# Altium schematic sheet hv_architecture.SchDoc
size B; SheetNumber: 3
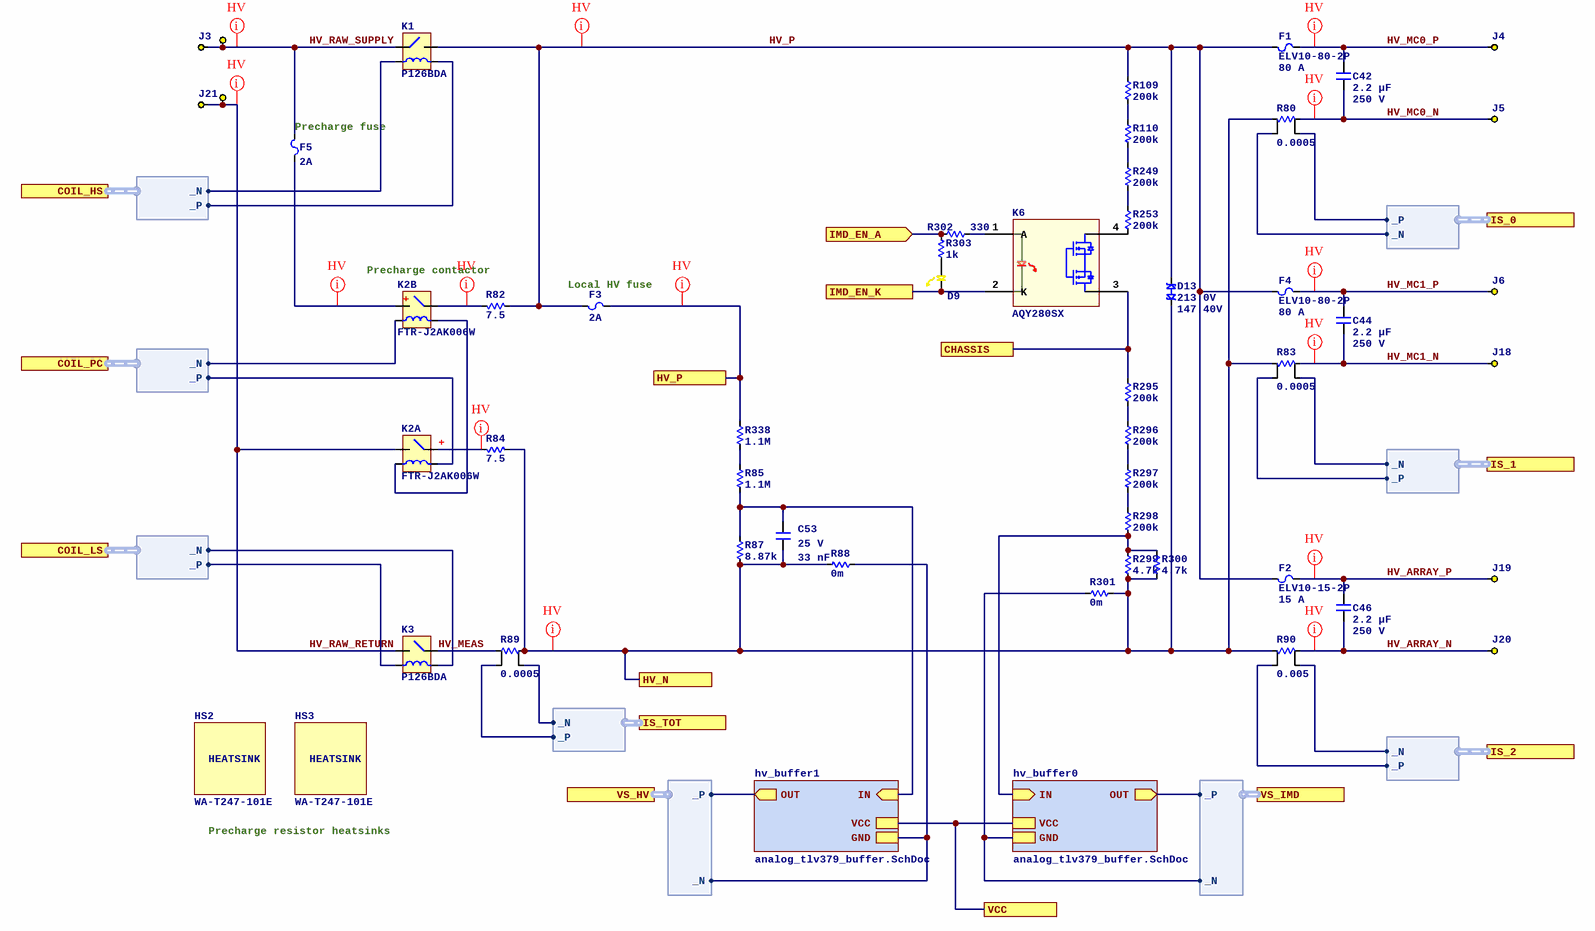
[diagram p0: hv_architecture.SchDoc]

## Parts
C42  Capacitance: 2.2 µF  Voltage Rating: 250 V  [C2220]  (hidden comment: C5750X7T2E225KT000N)
C44  Capacitance: 2.2 µF  Voltage Rating: 250 V  [C2220]  (hidden comment: C5750X7T2E225KT000N)
C46  Capacitance: 2.2 µF  Voltage Rating: 250 V  [C2220]  (hidden comment: C5750X7T2E225KT000N)
C53  Voltage Rating: 25 V  Capacitance: 33 nF  [C0402]  (hidden comment: 0402B333K250NT)
D9  LTST-C190YKT  [LED_0603P_YELLOW]  (value not drawn)
D13  Clamping Voltage-Max: 213.0V  Min Breakdown Voltage: 147.40V  [P600_VERTICAL]  (hidden comment: 30KPA132CA)
F1  ELV10-80-2P  Current: 80 A  [EATON_ELV10-xx-2P]
F2  ELV10-15-2P  Current: 15 A  [EATON_ELV10-xx-2P]
F3  Current: 2A  [BELFUSE_0ZRE0200FF]  (hidden comment: 0ZRE0200FF1A)
F4  ELV10-80-2P  Current: 80 A  [EATON_ELV10-xx-2P]
F5  Current: 2A  [BELFUSE_0ZRE0200FF]  (hidden comment: 0ZRE0200FF1A)
HS2  WA-T247-101E  [OHMITE_WA-T247-101E]
HS3  WA-T247-101E  [OHMITE_WA-T247-101E]
J3  7461086  [WURTH_TERM_7461086]  (value not drawn)
J4  7461086  [WURTH_TERM_7461086]  (value not drawn)
J5  7461086  [WURTH_TERM_7461086]  (value not drawn)
J6  7461086  [WURTH_TERM_7461086]  (value not drawn)
J18  7461086  [WURTH_TERM_7461086]  (value not drawn)
J19  7461086  [WURTH_TERM_7461086]  (value not drawn)
J20  7461086  [WURTH_TERM_7461086]  (value not drawn)
J21  7461086  [WURTH_TERM_7461086]  (value not drawn)
K1  P126BDA  [RELAY_P126]
K2  FTR-J2AK006W  [RELAY_FTR-J2]  (parts A,B of 2)
K3  P126BDA  [RELAY_P126]
K6  AQY280SX  [PANASONIC_AQY28]
R80  value 0.0005  [VISHAY_WSL2726]  (hidden comment: WSL2726L5000FEB)
R82  value 7.5  [TO-247-2_VERTICAL]  (hidden comment: TEH100M7R50FE)
R83  value 0.0005  [VISHAY_WSL2726]  (hidden comment: WSL2726L5000FEB)
R84  value 7.5  [TO-247-2_VERTICAL]  (hidden comment: TEH100M7R50FE)
R85  value 1.1M  [R0805]  (hidden comment: RT0805BRD071M1L)
R87  value 8.87k  [R0402]  (hidden comment: TC0210B8871TCC)
R88  value 0m  [R0402]  (hidden comment: 0402WGF0000TCE)
R89  value 0.0005  [VISHAY_WSL2726]  (hidden comment: WSL2726L5000FEB)
R90  value 0.005  [VISHAY_WSL2726]  (hidden comment: WSL27265L000FEB)
R109  value 200k  [R0603]  (hidden comment: 0603WAF2003T5E)
R110  value 200k  [R0603]  (hidden comment: 0603WAF2003T5E)
R249  value 200k  [R0603]  (hidden comment: 0603WAF2003T5E)
R253  value 200k  [R0603]  (hidden comment: 0603WAF2003T5E)
R295  value 200k  [R0603]  (hidden comment: 0603WAF2003T5E)
R296  value 200k  [R0603]  (hidden comment: 0603WAF2003T5E)
R297  value 200k  [R0603]  (hidden comment: 0603WAF2003T5E)
R298  value 200k  [R0603]  (hidden comment: 0603WAF2003T5E)
R299  value 4.7k  [R0402]  (hidden comment: 0402WGF4701TCE)
R300  value 4.7k  [R0402]  (hidden comment: 0402WGF4701TCE)
R301  value 0m  [R0402]  (hidden comment: 0402WGF0000TCE)
R302  value 330  [R0402]  (hidden comment: 0402WGF3300TCE)
R303  value 1k  [R0402]  (hidden comment: 0402WGF1001TCE)
R338  value 1.1M  [R0805]  (hidden comment: RT0805BRD071M1L)
TP3  RH-5000  [TP_RH-5000]  (value not drawn)
TP79  RH-5001  [TP_RH-5001]  (value not drawn)

## Sub-sheets
hv_buffer0 = analog_tlv379_buffer.SchDoc: IN (in), VCC, GND, OUT (out)
hv_buffer1 = analog_tlv379_buffer.SchDoc: IN (in), VCC, GND, OUT (out)

## Ports
CHASSIS, COIL_HS (harness DIFF), COIL_LS (harness DIFF), COIL_PC (harness DIFF), HV_N, HV_P, IMD_EN_A (in), IMD_EN_K, IS_0 (harness DIFF), IS_1 (harness DIFF), IS_2 (harness DIFF), IS_TOT (harness DIFF), VCC, VS_HV (harness DIFF), VS_IMD (harness DIFF)

## Harnesses
DIFF: _N, _P
DIFF: _P, _N

## Nets
CHASSIS: K6.3 R295.2 ; port CHASSIS
HV_ARRAY_N: C46.2 J20.0 R90.1
HV_ARRAY_P: C46.1 F2.2 J19.0
HV_MC0_N: C42.2 J5.0 R80.1
HV_MC0_P: C42.1 F1.2 J4.0
HV_MC1_N: C44.2 J18.0 R83.1
HV_MC1_P: C44.1 F4.2 J6.0
HV_MEAS: K3.4 R89.1
HV_N: C53.2 D13.1 R80.2 R83.2 R84.2 R87.2 R88.2 R89.2 R90.2 R299.1 R300.1 R301.2 ; port HV_N
HV_P: D13.2 F1.1 F2.1 F3.1 F4.1 K1.3 R82.2 R109.2
HV_P: F3.2 R338.1 ; port HV_P  [a separate net that carries the same name]
HV_RAW_RETURN: J21.0 K2.6 K3.3 TP79.1
HV_RAW_SUPPLY: F5.1 J3.0 K1.4 TP3.1
IMD_EN_A: R302.2 R303.1 ; port IMD_EN_A
IMD_EN_K: D9.2 K6.2(K) ; port IMD_EN_K
VCC: port VCC, sheet hv_buffer0/VCC, sheet hv_buffer1/VCC
NetC53_1: C53.1 R85.2 R87.1 ; sheet hv_buffer1/IN
NetD9_1: D9.1 R303.2
NetF5_2: F5.2 K2.8
NetK1_1: K1.1 ; port COIL_HS._N
NetK1_2: K1.2 ; port COIL_HS._P
NetK2_1: K2.1 ; port COIL_PC._P
NetK2_2: K2.2 K2.3
NetK2_4: K2.4 ; port COIL_PC._N
NetK2_5: K2.5 R84.1
NetK2_7: K2.7 R82.1
NetK3_1: K3.1 ; port COIL_LS._N
NetK3_2: K3.2 ; port COIL_LS._P
NetK6_1: K6.1(A) R302.1
NetK6_4: K6.4 R253.1
NetR80_3: R80.3 ; port IS_0._P
NetR80_4: R80.4 ; port IS_0._N
NetR83_3: R83.3 ; port IS_1._N
NetR83_4: R83.4 ; port IS_1._P
NetR85_1: R85.1 R338.2
NetR88_1: R88.1 ; sheet hv_buffer1/GND, port VS_HV._N
NetR89_3: R89.3 ; port IS_TOT._P
NetR89_4: R89.4 ; port IS_TOT._N
NetR90_3: R90.3 ; port IS_2._N
NetR90_4: R90.4 ; port IS_2._P
NetR109_1: R109.1 R110.2
NetR110_1: R110.1 R249.2
NetR249_1: R249.1 R253.2
NetR295_1: R295.1 R296.2
NetR296_1: R296.1 R297.2
NetR297_1: R297.1 R298.2
NetR298_1: R298.1 R299.2 R300.2 ; sheet hv_buffer0/IN
NetR301_1: R301.1 ; sheet hv_buffer0/GND, port VS_IMD._N
(unnamed): sheet hv_buffer0/OUT, port VS_IMD._P
(unnamed): sheet hv_buffer1/OUT, port VS_HV._P

## Layout directives
net class HV: HV_ARRAY_N, HV_ARRAY_P, HV_MC0_N, HV_MC0_P, HV_MC1_N, HV_MC1_P, HV_N, HV_P, HV_RAW_RETURN, HV_RAW_SUPPLY, NetF5_2, NetK2_5, NetK2_7

## Notes on the sheet
- (near F5) Precharge fuse
- Precharge contactor
- (near F3) Local HV fuse
- Precharge resistor heatsinks
- (in symbol FTR-J2AK006W, part A) +
- (in symbol FTR-J2AK006W, part B) +
- (in symbol WA-T247-101E) HEATSINK

## Library data of the parts
C42 C44 C46 = C5750X7T2E225KT000N: Manufacturer: TDK; Dielectric: X7T; ComponentLink1URL: https://wmsc.lcsc.com/wmsc/upload/file/pdf/v2/lcsc/2304140030_TDK-C5750X7T2E225KT000N_C435266.pdf; ComponentLink1Description: Datasheet; Manufacturer Part Number: C5750X7T2E225KT000N; Package: 2220; Supplier 2: LCSC; Supplier Part Number 2: C435266
C53 = 0402B333K250NT: Manufacturer: FH (Guangdong Fenghua Advanced Tech); Dielectric: X7R; Manufacturer Part Number: 0402B333K250NT; Package: 0402; Supplier 2: LCSC; Supplier Part Number 2: C285174; ComponentLink1Description: Datasheet; ComponentLink1URL: https://datasheet.lcsc.com/lcsc/2110191430_FH--Guangdong-Fenghua-Advanced-Tech-0402B333K250NT_C285174.pdf
D9 = LTST-C190YKT: LED YELLOW CLEAR 0603 SMD; Manufacturer: Lite-On Inc; Vf: 2.1 V; If: 20 mA; Supplier 1: DigiKey; ComponentLink1URL: https://mm.digikey.com/Volume0/opasdata/d220001/medias/docus/1176/LTST-C190YKT.pdf; ComponentLink1Description: Datasheet; Supplier Part Number 1: 160-1184-1-ND; Manufacturer Part Number: LTST-C190YKT; Supplier 2: LCSC; Supplier Part Number 2: C125097; LED Color: Yellow; Supplier 3: Mouser; Supplier Part Number 3: 859-LTST-C190YKT
D13 = 30KPA132CA: 213V Clamp 142.3A Ipp Tvs Diode Through Hole P600; Manufacturer: Littelfuse; Polarity: Bidirectional; Standoff (V): 132; Power (W): 30000; Supplier 1: DigiKey; Supplier Part Number 1: 30KPA132CACT-ND; Manufacturer Part Number: 30KPA132CA; ComponentLink1URL: https://www.littelfuse.com/assetdocs/littelfuse_tvs_diode_30kpa_datasheet.pdf; ComponentLink1Description: Datasheet; Supplier 2: LCSC; Supplier Part Number 2: C7175979
F1 F4 = ELV10-80-2P: FUSE EV 80A 200VDC 2P TERM; Manufacturer: Eaton; Fuse Type: Cartridge; VDC: 200 V; Supplier 1: DigiKey; Supplier Part Number 1: 283-ELV10-80-2P-ND; Manufacturer Part Number: ELV10-80-2P; ComponentLink1Description: Datasheet; ComponentLink1URL: https://www.eaton.com/content/dam/eaton/products/electronic-components/resources/data-sheet/eaton-elv10-10x25mm-ev-fuse-data-sheet-elx1302-en.pdf; Supplier 3: Mouser; Supplier Part Number 3: 504-ELV10-80-2P
F2 = ELV10-15-2P: 15A 200 VDC Fuse Cartridge Through Hole; Manufacturer: Eaton; VDC: 200 V; Supplier 1: DigiKey; Supplier Part Number 1: 283-ELV10-15-2P-ND; Manufacturer Part Number: ELV10-15-2P; ComponentLink1Description: Datasheet; ComponentLink1URL: https://www.eaton.com/content/dam/eaton/products/electronic-components/resources/data-sheet/eaton-elv10-10x25mm-ev-fuse-data-sheet-elx1302-en.pdf; Fuse Type: Cartridge; Supplier 3: Mouser; Supplier Part Number 3: 504-ELV10-15-2P
F3 F5 = 0ZRE0200FF1A: Polymeric PTC Resettable Fuse 240V 2 A Ih Through Hole Radial, Disc; Manufacturer: Bel Fuse Inc.; Fuse Type: Resettable PTC; Supplier 1: DigiKey; Supplier Part Number 1: 5923-0ZRE0200FF1A-ND; Manufacturer Part Number: 0ZRE0200FF1A; Supplier 2: LCSC; ComponentLink1Description: Datasheet; ComponentLink1URL: https://www.belfuse.com/media/datasheets/products/circuit-protection/ds-cp-0zre-series.pdf; VDC: 240 V; VAC: 240 V; Supplier Part Number 2: C3760983; Supplier 3: Mouser; Supplier Part Number 3: 530-0ZRE0200FF1A
HS2 HS3 = WA-T247-101E: Heat Sink, 11ohm, Extruded, Clip, Longitudinal, Aluminum Alloy, Anodized; Manufacturer: Ohmite; Supplier 1: DigiKey; Supplier Part Number 1: WA-T247-101E-ND; Manufacturer Part Number: WA-T247-101E; ComponentLink1Description: Datasheet; ComponentLink1URL: https://www.ohmite.com/assets/images/sink-w.pdf; Supplier 3: Mouser; Supplier Part Number 3: 588-WA-T247-101E
J3-J6 J18-J21 = 7461086: POWER ELEMENT BUSH M4 12PIN; Manufacturer: Wurth Electronics; Supplier 1: DigiKey; Supplier Part Number 1: 732-3207-ND; Manufacturer Part Number: 7461086; Supplier 2: LCSC; Supplier Part Number 2: C6089860; Supplier 3: Mouser; Supplier Part Number 3: 710-7461086; ComponentLink1Description: Datasheet; ComponentLink1URL: https://www.we-online.com/components/products/datasheet/7461086.pdf
K1 K3 = P126BDA: RELAY GEN PURPOSE SPST 60A 12V; Manufacturer: Sensata; Supplier 1: DigiKey; Supplier Part Number 1: 3596-P126BDA-ND; Manufacturer Part Number: P126BDA; ComponentLink1Description: Datasheet; ComponentLink1URL: https://www.sensata.com/sites/default/files/a/sensata-gigavac-p126-series-minitactor-contactors-datasheet.pdf; Supplier 3: Mouser; Supplier Part Number 3: 682-P126BDA
K2 = FTR-J2AK006W: General Purpose Relay 450VDC/10A; Manufacturer: Fujitsu; Manufacturer Part Number: FTR-J2AK006W; ComponentLink1URL: https://www.fcl-components.com/downloads/MICRO/fcai/relays/ftr-j2.pdf; ComponentLink1Description: Datasheet; Supplier 3: Mouser; Supplier Part Number 3: 817-FTR-J2AK006W
K6 = AQY280SX: Solid State Photo-Coupled Relay (Photorelay) SPST-NO (1 Form A) 4-SOP (0.173", 4.40mm); Manufacturer: Panasonic Industry; Supplier 1: DigiKey; Supplier Part Number 1: 255-3913-1-ND; Manufacturer Part Number: AQY280SX; ComponentLink1URL: https://mm.digikey.com/Volume0/opasdata/d220001/medias/docus/2807/AQY%2CW28xS_DS.pdf; ComponentLink1Description: Datasheet; Supplier 2: LCSC; Supplier Part Number 2: C425101; Supplier 3: Mouser; Supplier Part Number 3: 769-AQY280SX
R80 R83 R89 = WSL2726L5000FEB: Manufacturer: Vishay Dale; Tolerance: 1%; Power Rating (mW): 3000; Supplier 1: DigiKey; Manufacturer Part Number: WSL2726L5000FEB; ComponentLink1URL: http://www.vishay.com/docs/30131/wsl2726.pdf; ComponentLink1Description: Datasheet; Supplier Part Number 1: WSLQ-.0005CT-ND; Supplier 2: LCSC; Supplier Part Number 2: C4132421; Package: 2726
R82 R84 = TEH100M7R50FE: Manufacturer: Ohmite; Tolerance: 1%; Power Rating (mW): 100000; Supplier 1: DigiKey; Manufacturer Part Number: TEH100M7R50FE; ComponentLink1URL: http://www.ohmite.com/cat/res_teh100.pdf; ComponentLink1Description: Datasheet; Supplier Part Number 1: TEH100M7R50FE-ND; Supplier 2: LCSC; Supplier Part Number 2: C2641795; Package: TO-247
R85 R338 = RT0805BRD071M1L: Manufacturer: YAGEO; Tolerance: 0.1%; Temperature Coefficient: ±25ppm/?; Power Rating (mW): 125; ComponentLink1Description: Datasheet; ComponentLink1URL: https://wmsc.lcsc.com/wmsc/upload/file/pdf/v2/lcsc/2304140030_YAGEO-RT0805BRD071M1L_C136925.pdf; Manufacturer Part Number: RT0805BRD071M1L; Package: 0805; Supplier 2: LCSC; Supplier Part Number 2: C136925
R87 = TC0210B8871TCC: Manufacturer: UNI-ROYAL(Uniroyal Elec); Tolerance: 0.1%; Temperature Coefficient: ±10ppm/?; Power Rating (mW): 62.5; ComponentLink1Description: Datasheet; ComponentLink1URL: https://wmsc.lcsc.com/wmsc/upload/file/pdf/v2/lcsc/2409272202_UNI-ROYAL-Uniroyal-Elec-TC0210B8871TCC_C517790.pdf; Manufacturer Part Number: TC0210B8871TCC; Package: 0402; Supplier 2: LCSC; Supplier Part Number 2: C517790
R88 R301 = 0402WGF0000TCE: Manufacturer: UNI-ROYAL(Uniroyal Elec); Power Rating (mW): 62.5; ComponentLink1Description: Datasheet; ComponentLink1URL: https://wmsc.lcsc.com/wmsc/upload/file/pdf/v2/lcsc/2206010216_UNI-ROYAL-Uniroyal-Elec-0402WGF0000TCE_C17168.pdf; Manufacturer Part Number: 0402WGF0000TCE; Package: 0402; Supplier 2: LCSC; Supplier Part Number 2: C17168
R90 = WSL27265L000FEB: Manufacturer: Vishay Dale; Tolerance: 1%; Power Rating (mW): 3000; Supplier 1: DigiKey; Manufacturer Part Number: WSL27265L000FEB; ComponentLink1URL: http://www.vishay.com/docs/30131/wsl2726.pdf; ComponentLink1Description: Datasheet; Supplier Part Number 1: WSLQ-.005CT-ND; Supplier 2: LCSC; Supplier Part Number 2: C1517421; Package: 2726
R109 R110 R249 R253 R295-R298 = 0603WAF2003T5E: Manufacturer: UNI-ROYAL(Uniroyal Elec); Power Rating (mW): 100; Tolerance: 1%; Temperature Coefficient: ±100ppm/?; Manufacturer Part Number: 0603WAF2003T5E; Package: 0603; Supplier 2: LCSC; Supplier Part Number 2: C25811; ComponentLink1Description: Datasheet; ComponentLink1URL: https://wmsc.lcsc.com/wmsc/upload/file/pdf/v2/lcsc/2206010045_UNI-ROYAL-Uniroyal-Elec-0603WAF2003T5E_C25811.pdf
R299 R300 = 0402WGF4701TCE: Manufacturer: UNI-ROYAL(Uniroyal Elec); Power Rating (mW): 62.5; Tolerance: 1%; Temperature Coefficient: ±100ppm/?; Manufacturer Part Number: 0402WGF4701TCE; Package: 0402; Supplier 2: LCSC; Supplier Part Number 2: C25900; ComponentLink1Description: Datasheet; ComponentLink1URL: https://wmsc.lcsc.com/wmsc/upload/file/pdf/v2/lcsc/2206010045_UNI-ROYAL-Uniroyal-Elec-0402WGF4701TCE_C25900.pdf
R302 = 0402WGF3300TCE: Manufacturer: UNI-ROYAL(Uniroyal Elec); Tolerance: 1%; Temperature Coefficient: ±100ppm/?; Power Rating (mW): 62.5; ComponentLink1Description: Datasheet; ComponentLink1URL: https://wmsc.lcsc.com/wmsc/upload/file/pdf/v2/lcsc/2205311900_UNI-ROYAL-Uniroyal-Elec-0402WGF3300TCE_C25104.pdf; Manufacturer Part Number: 0402WGF3300TCE; Package: 0402; Supplier 2: LCSC; Supplier Part Number 2: C25104
R303 = 0402WGF1001TCE: Manufacturer: UNI-ROYAL(Uniroyal Elec); Tolerance: 1%; Temperature Coefficient: ±100ppm/?; Power Rating (mW): 62.5; ComponentLink1Description: Datasheet; ComponentLink1URL: https://wmsc.lcsc.com/wmsc/upload/file/pdf/v2/lcsc/2206010216_UNI-ROYAL-Uniroyal-Elec-0402WGF1001TCE_C11702.pdf; Manufacturer Part Number: 0402WGF1001TCE; Package: 0402; Supplier 2: LCSC; Supplier Part Number 2: C11702
TP3 = RH-5000: Red through-hole PCB test point; Manufacturer: ronghe; ComponentLink1Description: Datasheet; ComponentLink1URL: https://datasheet.lcsc.com/lcsc/2307040929_ronghe-RH-5000_C5277086.pdf; Manufacturer Part Number: RH-5000; Supplier 2: LCSC; Supplier Part Number 2: C5277086
TP79 = RH-5001: Black through-hole PCB test point; Manufacturer: ronghe; ComponentLink1Description: Datasheet; ComponentLink1URL: https://datasheet.lcsc.com/lcsc/2307040929_ronghe-RH-5000_C5277086.pdf; Manufacturer Part Number: RH-5001; Supplier 2: LCSC; Supplier Part Number 2: C5199801